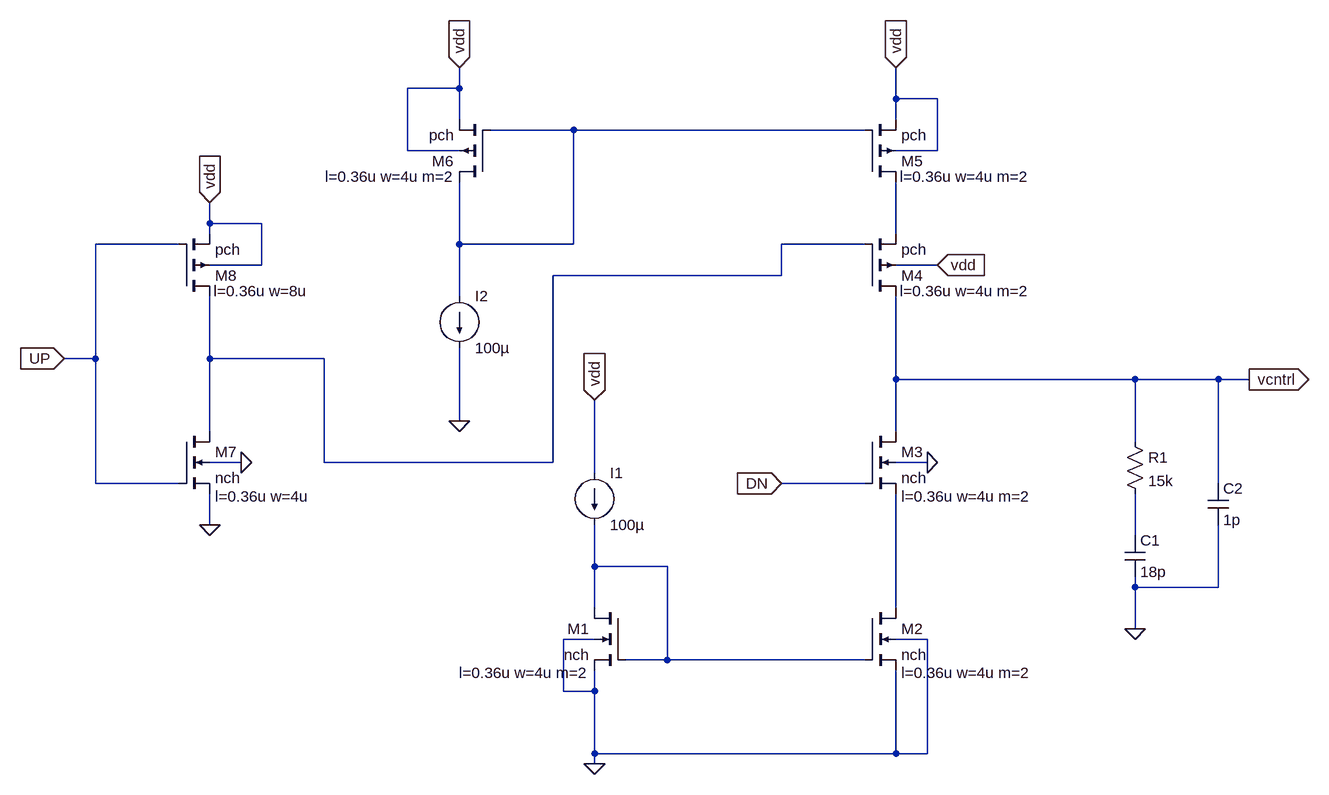
[diagram p0: schematic simple_CP_sym.asc]
simple_CP_sym.asc, the LTspice schematic file:
Version 4
SHEET 1 1216 680
WIRE -128 -640 -128 -672
WIRE -128 -640 -208 -640
WIRE 544 -624 544 -672
WIRE 608 -624 544 -624
WIRE -128 -592 -128 -640
WIRE 544 -592 544 -624
WIRE 48 -576 -80 -576
WIRE 496 -576 48 -576
WIRE -208 -544 -208 -640
WIRE -128 -544 -208 -544
WIRE 608 -544 608 -624
WIRE 608 -544 544 -544
WIRE -512 -432 -512 -464
WIRE -432 -432 -512 -432
WIRE -512 -416 -512 -432
WIRE 544 -416 544 -496
WIRE -560 -400 -688 -400
WIRE -128 -400 -128 -496
WIRE 48 -400 48 -576
WIRE 48 -400 -128 -400
WIRE 496 -400 368 -400
WIRE -432 -368 -432 -432
WIRE -432 -368 -512 -368
WIRE 608 -368 544 -368
WIRE 368 -352 368 -400
WIRE 368 -352 16 -352
WIRE -128 -320 -128 -400
WIRE -688 -224 -688 -400
WIRE -688 -224 -736 -224
WIRE -512 -224 -512 -320
WIRE -336 -224 -512 -224
WIRE 544 -192 544 -320
WIRE 912 -192 544 -192
WIRE 1040 -192 912 -192
WIRE 1088 -192 1040 -192
WIRE -128 -128 -128 -240
WIRE -512 -112 -512 -224
WIRE 544 -112 544 -192
WIRE 912 -96 912 -192
WIRE -464 -64 -512 -64
WIRE -336 -64 -336 -224
WIRE 16 -64 16 -352
WIRE 16 -64 -336 -64
WIRE 592 -64 544 -64
WIRE 80 -48 80 -160
WIRE -688 -32 -688 -224
WIRE -560 -32 -688 -32
WIRE 496 -32 368 -32
WIRE 1040 -32 1040 -192
WIRE -512 32 -512 -16
WIRE 912 48 912 -16
WIRE 80 96 80 32
WIRE 192 96 80 96
WIRE 912 128 912 112
WIRE 1040 128 1040 32
WIRE 1040 128 912 128
WIRE 80 160 80 96
WIRE 544 160 544 -16
WIRE 912 192 912 128
WIRE 80 208 32 208
WIRE 592 208 544 208
WIRE 192 240 192 96
WIRE 192 240 128 240
WIRE 496 240 192 240
WIRE 32 288 32 208
WIRE 80 288 80 256
WIRE 80 288 32 288
WIRE 80 384 80 288
WIRE 544 384 544 256
WIRE 544 384 80 384
WIRE 592 384 592 208
WIRE 592 384 544 384
WIRE 80 400 80 384
FLAG 80 400 0
FLAG 80 -160 vdd
IOPIN 80 -160 In
FLAG 592 -64 0
FLAG -128 -128 0
FLAG 912 192 0
FLAG 1088 -192 vcntrl
IOPIN 1088 -192 Out
FLAG 368 -32 DN
IOPIN 368 -32 In
FLAG -464 -64 0
FLAG -512 -464 vdd
IOPIN -512 -464 In
FLAG -512 32 0
FLAG -736 -224 UP
IOPIN -736 -224 In
FLAG -128 -672 vdd
IOPIN -128 -672 In
FLAG 544 -672 vdd
IOPIN 544 -672 In
FLAG 608 -368 vdd
IOPIN 608 -368 In
SYMBOL nmos4 128 160 M0
WINDOW 123 56 100 Left 2
SYMATTR Value2 l=0.36u w=4u m=2
SYMATTR InstName M1
SYMATTR Value nch
SYMBOL current 80 -48 R0
WINDOW 123 0 0 Left 0
WINDOW 39 0 0 Left 0
SYMATTR InstName I1
SYMATTR Value 100µ
SYMBOL nmos4 496 160 R0
WINDOW 123 56 100 Left 2
SYMATTR Value2 l=0.36u w=4u m=2
SYMATTR InstName M2
SYMATTR Value nch
SYMBOL nmos4 496 -112 R0
WINDOW 123 56 100 Left 2
SYMATTR Value2 l=0.36u w=4u m=2
SYMATTR InstName M3
SYMATTR Value nch
SYMBOL pmos4 496 -320 M180
WINDOW 123 54 8 Left 2
SYMATTR Value2 l=0.36u w=4u m=2
SYMATTR InstName M4
SYMATTR Value pch
SYMBOL pmos4 496 -496 M180
WINDOW 123 54 8 Left 2
SYMATTR Value2 l=0.36u w=4u m=2
SYMATTR InstName M5
SYMATTR Value pch
SYMBOL pmos4 -80 -496 R180
WINDOW 123 54 8 Left 2
SYMATTR Value2 l=0.36u w=4u m=2
SYMATTR InstName M6
SYMATTR Value pch
SYMBOL current -128 -320 R0
WINDOW 123 0 0 Left 0
WINDOW 39 0 0 Left 0
SYMATTR InstName I2
SYMATTR Value 100µ
SYMBOL res 896 -112 R0
SYMATTR InstName R1
SYMATTR Value 15k
SYMBOL cap 896 48 R0
SYMATTR InstName C1
SYMATTR Value 18p
SYMBOL cap 1024 -32 R0
SYMATTR InstName C2
SYMATTR Value 1p
SYMBOL nmos4 -560 -112 R0
WINDOW 123 56 100 Left 2
SYMATTR Value2 l=0.36u w=4u
SYMATTR InstName M7
SYMATTR Value nch
SYMBOL pmos4 -560 -320 M180
WINDOW 123 54 8 Left 2
SYMATTR Value2 l=0.36u w=8u
SYMATTR InstName M8
SYMATTR Value pch

The netlist it stands for:
* simple_CP_sym.asc
M1 N005 N005 0 0 nch l=0.36u w=4u m=2
I1 vdd N005 100µ
M2 N006 N005 0 0 nch l=0.36u w=4u m=2
M3 vcntrl DN N006 0 nch l=0.36u w=4u m=2
M4 vcntrl N003 N002 vdd pch l=0.36u w=4u m=2
M5 N002 N001 vdd vdd pch l=0.36u w=4u m=2
M6 N001 N001 vdd vdd pch l=0.36u w=4u m=2
I2 N001 0 100µ
R1 vcntrl N004 15k
C1 N004 0 18p
C2 vcntrl 0 1p
M7 N003 UP 0 0 nch l=0.36u w=4u
M8 N003 UP vdd vdd pch l=0.36u w=8u
.model NMOS NMOS
.model PMOS PMOS
.lib standard.mos
.backanno
.end